# EAGLE design ftdi2kondo2 (EAGLE 5.09)
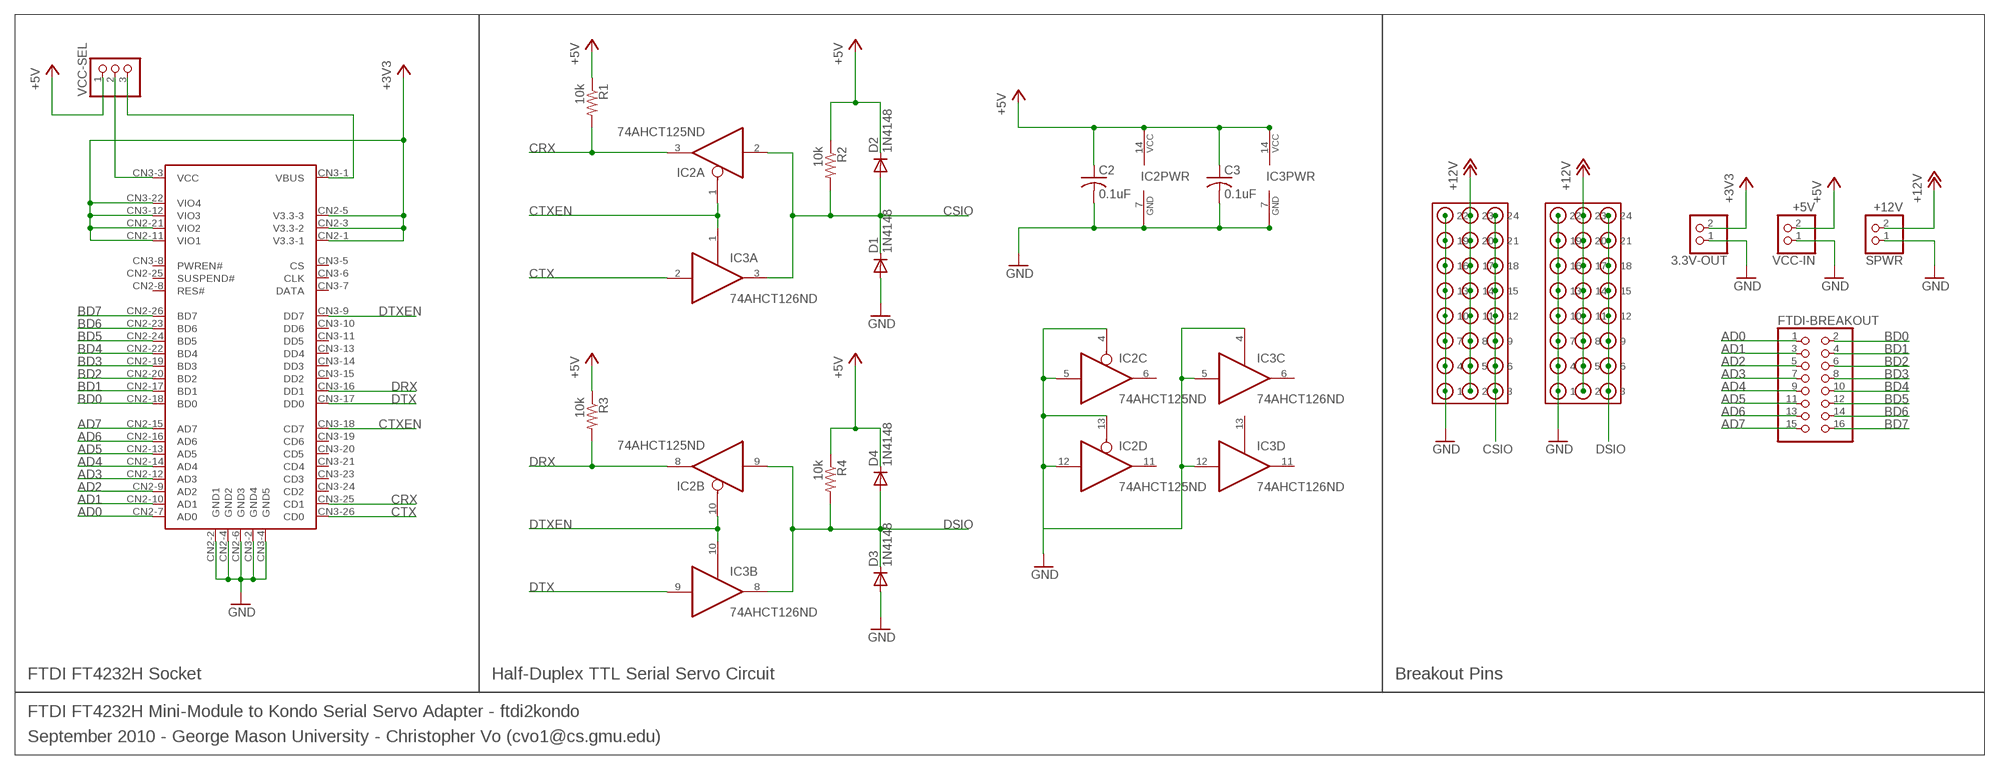
[diagram p0: schematic, sheet 1]

## Parts
3.3V-OUT  PINHD-1X2  [1X02]
C2  0.1uF  C-US025-025X050  [C025-025X050]
C3  0.1uF  C-US025-025X050  [C025-025X050]
CSIO-HEADER  3X8  [3X8]
D1  1N4148  1N4148DO35-7  [DO35-7]
D2  1N4148  1N4148DO35-7  [DO35-7]
D3  1N4148  1N4148DO35-7  [DO35-7]
D4  1N4148  1N4148DO35-7  [DO35-7]
DSIO-HEADER  3X8  [3X8]
FTDI-BREAKOUT  PINHD-2X8  [2X08]
IC1  FT4232HMOD  [FT4232H]
IC2  74AHCT125ND  [SO14]
IC3  74AHCT126ND  [SO14]
R1  10k  R-US_0204/5  [0204/5]
R2  10k  R-US_0204/5  [0204/5]
R3  10k  R-US_0204/5  [0204/5]
R4  10k  R-US_0204/5  [0204/5]
SPWR  +12V  PINHD-1X2  [1X02]
VCC-IN  +5V  PINHD-1X2  [1X02]
VCC-SEL  PINHD-1X3  [1X03]

## Nets
+3V3: 3.3V-OUT.2 IC1.CN2-1(V3.3-1) IC1.CN2-3(V3.3-2) IC1.CN2-5(V3.3-3) IC1.CN2-11(VIO1) IC1.CN2-21(VIO2) IC1.CN3-12(VIO3) IC1.CN3-22(VIO4)
+5V: C2.1 C3.1 D2.C D4.C IC2.14(PWR:VCC) IC3.14(PWR:VCC) R1.1 R2.1 R3.1 R4.1 VCC-IN.2 VCC-SEL.1
+12V: CSIO-HEADER.P$2 CSIO-HEADER.P$5 CSIO-HEADER.P$8 CSIO-HEADER.P$11 CSIO-HEADER.P$14 CSIO-HEADER.P$17 CSIO-HEADER.P$20 CSIO-HEADER.P$23 DSIO-HEADER.P$2 DSIO-HEADER.P$5 DSIO-HEADER.P$8 DSIO-HEADER.P$11 DSIO-HEADER.P$14 DSIO-HEADER.P$17 DSIO-HEADER.P$20 DSIO-HEADER.P$23 SPWR.2
AD0: FTDI-BREAKOUT.1 IC1.CN2-7(AD0)
AD1: FTDI-BREAKOUT.3 IC1.CN2-10(AD1)
AD2: FTDI-BREAKOUT.5 IC1.CN2-9(AD2)
AD3: FTDI-BREAKOUT.7 IC1.CN2-12(AD3)
AD4: FTDI-BREAKOUT.9 IC1.CN2-14(AD4)
AD5: FTDI-BREAKOUT.11 IC1.CN2-13(AD5)
AD6: FTDI-BREAKOUT.13 IC1.CN2-16(AD6)
AD7: FTDI-BREAKOUT.15 IC1.CN2-15(AD7)
BD0: FTDI-BREAKOUT.2 IC1.CN2-18(BD0)
BD1: FTDI-BREAKOUT.4 IC1.CN2-17(BD1)
BD2: FTDI-BREAKOUT.6 IC1.CN2-20(BD2)
BD3: FTDI-BREAKOUT.8 IC1.CN2-19(BD3)
BD4: FTDI-BREAKOUT.10 IC1.CN2-22(BD4)
BD5: FTDI-BREAKOUT.12 IC1.CN2-24(BD5)
BD6: FTDI-BREAKOUT.14 IC1.CN2-23(BD6)
BD7: FTDI-BREAKOUT.16 IC1.CN2-26(BD7)
CRX: IC1.CN3-25(CD1) IC2.3(A:O) R1.2
CSIO: CSIO-HEADER.P$3 CSIO-HEADER.P$6 CSIO-HEADER.P$9 CSIO-HEADER.P$12 CSIO-HEADER.P$15 CSIO-HEADER.P$18 CSIO-HEADER.P$21 CSIO-HEADER.P$24 D1.C D2.A IC2.2(A:I) IC3.3(A:O) R2.2
CTX: IC1.CN3-26(CD0) IC3.2(A:I)
CTXEN: IC1.CN3-18(CD7) IC2.1(A:OE) IC3.1(A:OE)
DRX: IC1.CN3-16(DD1) IC2.8(B:O) R3.2
DSIO: D3.C D4.A DSIO-HEADER.P$3 DSIO-HEADER.P$6 DSIO-HEADER.P$9 DSIO-HEADER.P$12 DSIO-HEADER.P$15 DSIO-HEADER.P$18 DSIO-HEADER.P$21 DSIO-HEADER.P$24 IC2.9(B:I) IC3.8(B:O) R4.2
DTX: IC1.CN3-17(DD0) IC3.9(B:I)
DTXEN: IC1.CN3-9(DD7) IC2.10(B:OE) IC3.10(B:OE)
GND: 3.3V-OUT.1 C2.2 C3.2 CSIO-HEADER.P$1 CSIO-HEADER.P$4 CSIO-HEADER.P$7 CSIO-HEADER.P$10 CSIO-HEADER.P$13 CSIO-HEADER.P$16 CSIO-HEADER.P$19 CSIO-HEADER.P$22 D1.A D3.A DSIO-HEADER.P$1 DSIO-HEADER.P$4 DSIO-HEADER.P$7 DSIO-HEADER.P$10 DSIO-HEADER.P$13 DSIO-HEADER.P$16 DSIO-HEADER.P$19 DSIO-HEADER.P$22 IC1.CN2-2(GND1) IC1.CN2-4(GND2) IC1.CN2-6(GND3) IC1.CN3-2(GND4) IC1.CN3-4(GND5) IC2.4(C:OE) IC2.5(C:I) IC2.7(PWR:GND) IC2.12(D:I) IC2.13(D:OE) IC3.4(C:OE) IC3.5(C:I) IC3.7(PWR:GND) IC3.12(D:I) SPWR.1 VCC-IN.1
N$1: IC1.CN3-3(VCC) VCC-SEL.2
VBUS: IC1.CN3-1(VBUS) VCC-SEL.3
Unconnected: IC1.CN2-8(RES#) IC1.CN2-25(SUSPEND#) IC1.CN3-5(CS) IC1.CN3-6(CLK) IC1.CN3-7(DATA) IC1.CN3-8(PWREN#) IC1.CN3-10(DD6) IC1.CN3-11(DD5) IC1.CN3-13(DD4) IC1.CN3-14(DD3) IC1.CN3-15(DD2) IC1.CN3-19(CD6) IC1.CN3-20(CD5) IC1.CN3-21(CD4) IC1.CN3-23(CD3) IC1.CN3-24(CD2) IC2.6(C:O) IC2.11(D:O) IC3.6(C:O) IC3.11(D:O) IC3.13(D:OE)

## Notes on the sheet
- FTDI FT4232H Socket | Half-Duplex TTL Serial Servo Circuit | Breakout Pins
- FTDI FT4232H Mini-Module to Kondo Serial Servo Adapter - ftdi2kondo
- September 2010 - George Mason University - Christopher Vo (cvo1@cs.gmu.edu)

## Library data of the parts
3.3V-OUT SPWR VCC-IN = pinhead:PINHD-1X2: PIN HEADER
C2 C3 = resistor:C-US: CAPACITOR, American symbol
CSIO-HEADER DSIO-HEADER = ftdi2kondo:3X8
D1-D4 = diode:1N4148: DIODE high speed (Philips)
FTDI-BREAKOUT = pinhead:PINHD-2X8: PIN HEADER
IC1 = ftdi2kondo:FT4232H
IC2 = ftdi2kondo:74*125
IC3 = ftdi2kondo:74*126
R1-R4 = resistor:R-US_: RESISTOR, American symbol
VCC-SEL = pinhead:PINHD-1X3: PIN HEADER

## Board
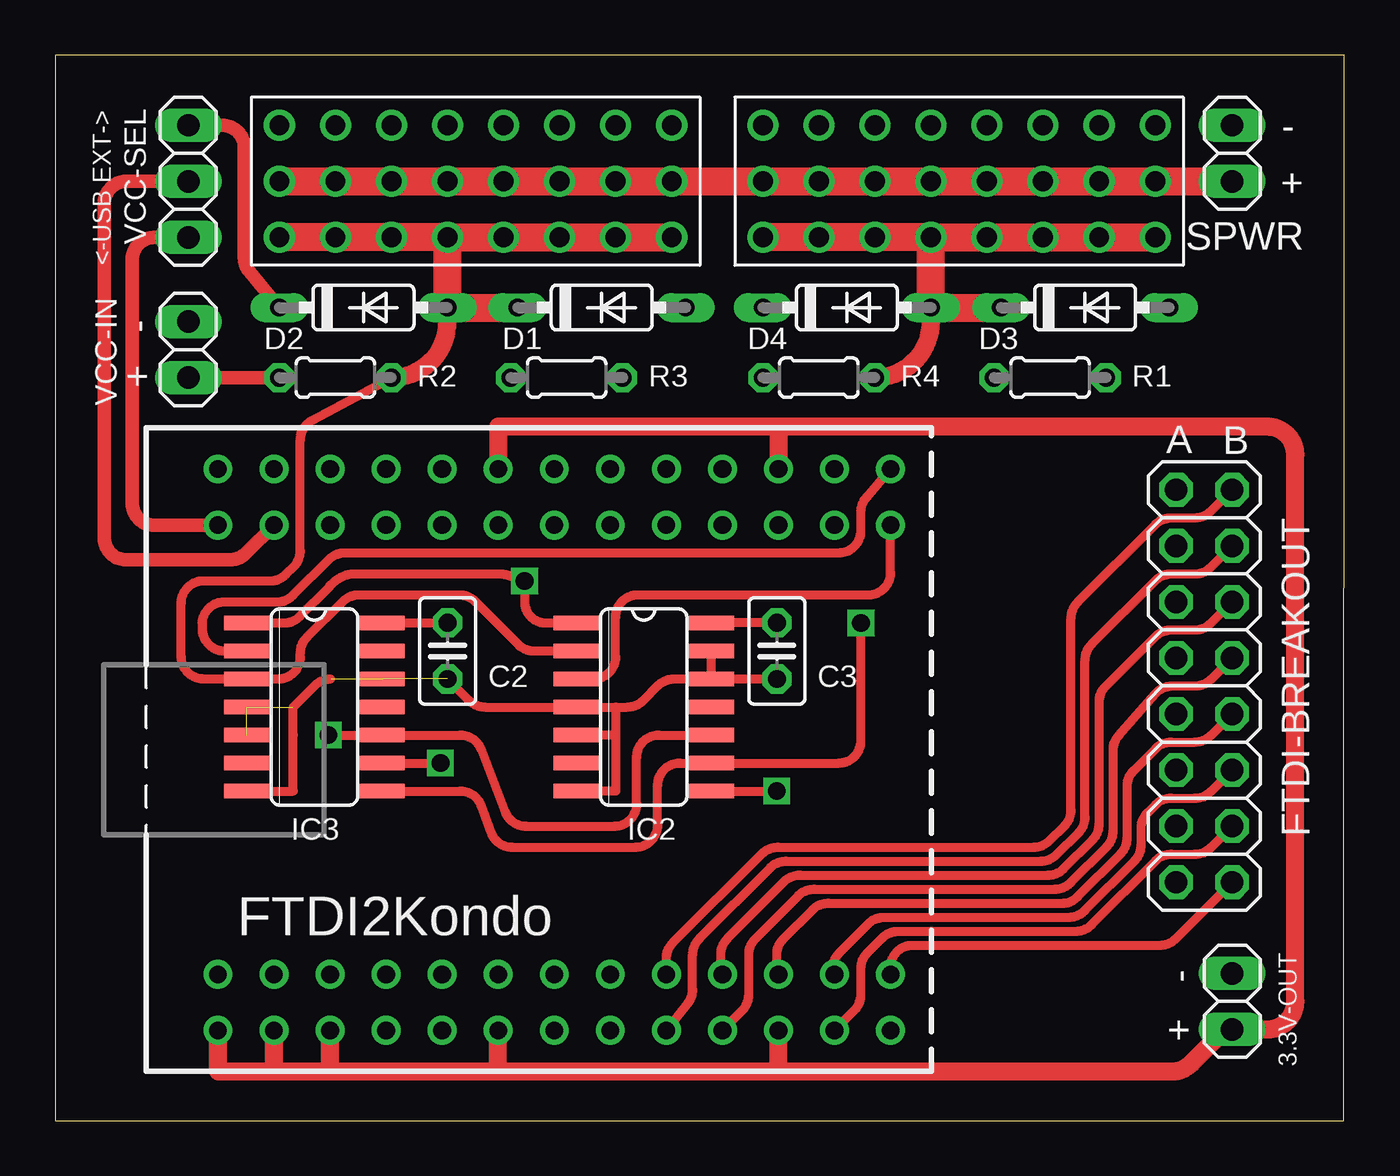
[diagram p1: board, top side]
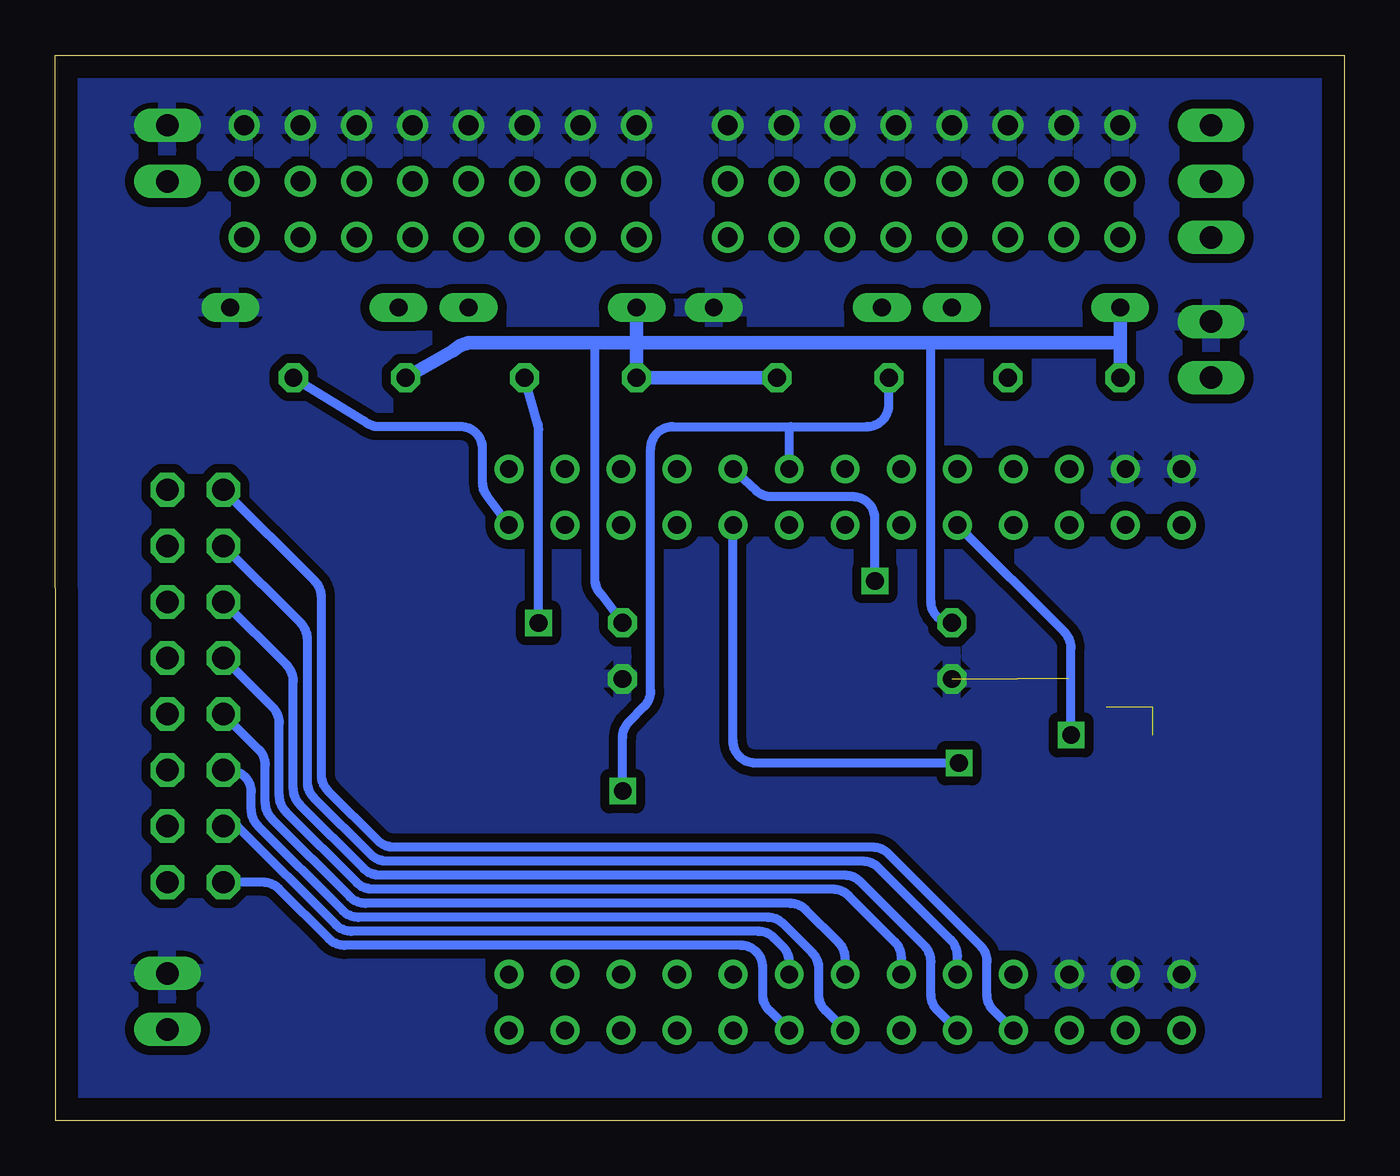
[diagram p2: board, bottom side, seen from below]

Size 58.42 x 48.26 mm. Coordinates in mm from the lower left corner, seen from the top.
Outline: 0,0 58.4,0 58.42,48.26 0,48.26 0,0
Copper layers (1*16): Top 0.035mm / dielectric 1.5mm / Bottom 0.035mm
Design rules "default": minimum track width 10mil, minimum drill 24mil, track to track 8mil, track to pad 8mil, pad to pad 8mil, via to via 8mil, smd to smd 8mil, copper to edge 40mil, drill to drill 8mil, minimum pad ring 10mil, minimum via ring 8mil, stop-mask expansion 4mil, vias tented up to drill 0mil, thermal gap 10mil

### Footprints (pad centres in the part's own frame; a part is rotated, then mirrored left to right if it is on the bottom)
1X02 = drill 1.016 long: 1 -1.27,0; 2 1.27,0
C025-025X050 = drill 0.813 octagon: 1 -1.27,0; 2 1.27,0
3X8 = drill 0.9 round: P$1 0,0; P$2 2.54,0; P$3 5.08,0; P$4 0,2.54; P$5 2.54,2.54; P$6 5.08,2.54; P$7 0,5.08; P$8 2.54,5.08; P$9 5.08,5.08; P$10 0,7.62; P$11 2.54,7.62; P$12 5.08,7.62; P$13 0,10.16; P$14 2.54,10.16; P$15 5.08,10.16; P$16 0,12.7; P$17 2.54,12.7; P$18 5.08,12.7; P$19 0,15.24; P$20 2.54,15.24; P$21 5.08,15.24; P$22 0,17.78; P$23 2.54,17.78; P$24 5.08,17.78
DO35-7 = drill 0.813 long: A 3.81,0; C -3.81,0
2X08 = drill 1.016 octagon: 1 -8.89,-1.27; 2 -8.89,1.27; 3 -6.35,-1.27; 4 -6.35,1.27; 5 -3.81,-1.27; 6 -3.81,1.27; 7 -1.27,-1.27; 8 -1.27,1.27; 9 1.27,-1.27; 10 1.27,1.27; 11 3.81,-1.27; 12 3.81,1.27; 13 6.35,-1.27; 14 6.35,1.27; 15 8.89,-1.27; 16 8.89,1.27
FT4232H = drill 0.8 round: CN2-1 3.25,1.86; CN2-2 3.25,4.4; CN2-3 5.79,1.86; CN2-4 5.79,4.4; CN2-5 8.33,1.86; CN2-6 8.33,4.4; CN2-7 10.87,1.86; CN2-8 10.87,4.4; CN2-9 13.41,1.86; CN2-10 13.41,4.4; CN2-11 15.95,1.86; CN2-12 15.95,4.4; CN2-13 18.49,1.86; CN2-14 18.49,4.4; CN2-15 21.03,1.86; CN2-16 21.03,4.4; CN2-17 23.57,1.86; CN2-18 23.57,4.4; CN2-19 26.11,1.86; CN2-20 26.11,4.4; CN2-21 28.65,1.86; CN2-22 28.65,4.4; CN2-23 31.19,1.86; CN2-24 31.19,4.4; CN2-25 33.73,1.86; CN2-26 33.73,4.4; CN3-1 3.25,24.75; CN3-2 3.25,27.29; CN3-3 5.79,24.75; CN3-4 5.79,27.29; CN3-5 8.33,24.75; CN3-6 8.33,27.29; CN3-7 10.87,24.75; CN3-8 10.87,27.29; CN3-9 13.41,24.75; CN3-10 13.41,27.29; CN3-11 15.95,24.75; CN3-12 15.95,27.29; CN3-13 18.49,24.75; CN3-14 18.49,27.29; CN3-15 21.03,24.75; CN3-16 21.03,27.29; CN3-17 23.57,24.75; CN3-18 23.57,27.29; CN3-19 26.11,24.75; CN3-20 26.11,27.29; CN3-21 28.65,24.75; CN3-22 28.65,27.29; CN3-23 31.19,24.75; CN3-24 31.19,27.29; CN3-25 33.73,24.75; CN3-26 33.73,27.29
SO14 = smd 0.66 x 2.032: 1 0,0.737; 2 1.27,0.737; 3 2.54,0.737; 4 3.81,0.737; 5 5.08,0.737; 6 6.35,0.737; 7 7.62,0.737; 8 7.62,6.883; 9 6.35,6.883; 10 5.08,6.883; 11 3.81,6.883; 12 2.54,6.883; 13 1.27,6.883; 14 0,6.883
0204/5 = drill 0.813 octagon: 1 -2.54,0; 2 2.54,0
1X03 = drill 1.016 long: 1 -2.54,0; 2 0,0; 3 2.54,0

### Placement (x,y rotation side)
3.3V-OUT  53.34,5.4 270 top
C2  17.78,21.27 270 top
C3  32.7,21.27 270 top
CSIO-HEADER  10.16,45.09 270 top
D1  24.77,36.83 0 top
D2  13.97,36.83 0 top
D3  46.67,36.83 0 top
D4  35.88,36.83 0 top
DSIO-HEADER  32.07,45.09 270 top
FTDI-BREAKOUT  52.07,19.68 270 top
IC1  4.13,2.22 0 top
IC2  22.86,22.54 270 top
IC3  7.94,22.54 270 top
R1  45.09,33.66 0 top
R2  12.7,33.66 0 top
R3  23.18,33.66 180 top
R4  34.61,33.66 0 top
SPWR  53.34,43.81 270 top
VCC-IN  6.03,34.92 270 top
VCC-SEL  6.03,42.55 270 top

### Tracks (layer width: path | path; a pad name or v marks a point on that pad's centre or on a via)
+3V3
  Top 0.813: 9.84,2.22 7.39,2.22 arc-45 7.38,2.26 IC1.CN2-1 | 9.84,2.22 12.38,2.22 | 12.38,2.22 20,2.22 | 20,2.22 32.7,2.22 | 32.7,2.22 50.59,2.22 arc45 51.49,2.6 53.02,4.13 3.3V-OUT.2 54.93,4.13 arc90 56.2,5.4 56.2,30.16 arc90 54.93,31.43 32.78,31.43 | IC1.CN2-5 12.46,2.3 12.38,2.22 | IC1.CN2-21 32.78,2.3 32.7,2.22 | IC1.CN2-11 20.08,2.3 20,2.22 | IC1.CN3-12 20.08,31.43 32.78,31.43 | 32.78,31.43 IC1.CN3-22 | IC1.CN2-3 9.92,2.3 arc-90 9.84,2.22
+5V
  Top 0.406: IC3.14 C2.1 | C3.1 IC2.14
  Top 0.61: VCC-SEL.1 7.57,45.09 arc-90 8.57,44.09 8.57,39.1 arc40 8.8,38.46 D2.C | R2.1 VCC-IN.2
  Bottom 0.406: C2.1 arc90 18.73,23.5 18.73,35.24 | C3.1 33.68,23.84 arc45 33.97,24.54 33.97,35.24
  Bottom 0.61: 10.16,35.24 18.73,35.24 32.07,35.24 | 32.07,35.24 33.97,35.24 39.48,35.24 arc-45 40.38,34.87 R1.1 | 10.16,35.24 R2.1 | 10.16,35.24 D2.C | R3.1 R4.1 32.07,35.24 | 32.07,35.24 D4.C
+12V
  Top 1.27: CSIO-HEADER.P$2 CSIO-HEADER.P$5 CSIO-HEADER.P$8 CSIO-HEADER.P$11 CSIO-HEADER.P$14 CSIO-HEADER.P$17 CSIO-HEADER.P$20 CSIO-HEADER.P$23 DSIO-HEADER.P$2 DSIO-HEADER.P$5 DSIO-HEADER.P$8 DSIO-HEADER.P$11 DSIO-HEADER.P$14 DSIO-HEADER.P$17 DSIO-HEADER.P$20 DSIO-HEADER.P$23 SPWR.2
AD0
  Bottom 0.406: FTDI-BREAKOUT.1 46.65,24.42 arc45 46.35,23.72 46.35,15.65 arc-45 46.06,14.95 43.79,12.68 arc-45 43.08,12.38 21.37,12.38 arc45 20.66,12.09 16.48,7.91 arc45 16.19,7.21 16.19,5.69 arc-45 15.9,4.99 IC1.CN2-7
AD1
  Bottom 0.406: FTDI-BREAKOUT.3 47.28,22.52 arc45 46.99,21.81 46.99,15.34 arc-45 46.7,14.63 44.11,12.04 arc-45 43.4,11.75 21.82,11.75 arc45 21.11,11.46 17.83,8.17 arc45 17.53,7.46 IC1.CN2-10
AD2
  Bottom 0.406: FTDI-BREAKOUT.5 47.92,20.61 arc45 47.62,19.91 47.62,15.02 arc-45 47.33,14.31 44.42,11.4 arc-45 43.72,11.11 22.64,11.11 arc45 21.93,10.82 19.02,7.91 arc45 18.73,7.21 18.73,5.69 arc-45 18.44,4.99 IC1.CN2-9
AD3
  Bottom 0.406: FTDI-BREAKOUT.7 48.55,18.71 arc45 48.26,18 48.26,14.7 arc-45 47.97,13.99 44.74,10.77 arc-45 44.04,10.48 23.17,10.48 arc45 22.46,10.19 20.36,8.08 arc45 20.07,7.37 20.07,6.63 IC1.CN2-12
AD4
  Bottom 0.406: FTDI-BREAKOUT.9 49.19,16.8 arc45 48.9,16.1 48.9,14.38 arc-45 48.6,13.68 45.06,10.13 arc-45 44.35,9.84 25.12,9.84 arc45 24.41,9.55 22.91,8.05 arc45 22.62,7.34 IC1.CN2-14
AD5
  Bottom 0.406: FTDI-BREAKOUT.11 50.53,15.88 arc90 49.53,14.88 49.53,14.07 arc-45 49.24,13.36 45.38,9.5 arc-45 44.67,9.21 26.13,9.21 arc45 25.43,8.91 24.11,7.59 arc45 23.81,6.89 23.81,5.69 arc-45 23.52,4.99 IC1.CN2-13
AD6
  Bottom 0.406: FTDI-BREAKOUT.13 50.16,13.34 45.7,8.87 arc-45 44.99,8.57 26.56,8.57 arc45 25.85,8.28 25.44,7.88 arc45 25.15,7.17 IC1.CN2-16
AD7
  Bottom 0.406: FTDI-BREAKOUT.15 48.99,10.79 arc45 48.28,10.5 46.01,8.23 arc-45 45.31,7.94 27.35,7.94 arc90 26.35,6.94 26.35,5.69 arc-45 26.06,4.99 IC1.CN2-15
BD0
  Top 0.406: FTDI-BREAKOUT.2 52.36,27.6 arc-45 51.66,27.3 50.58,27.3 arc45 49.87,27.01 46.33,23.47 arc45 46.04,22.76 46.04,14.07 arc-45 45.74,13.36 45.06,12.68 arc-45 44.35,12.38 32.74,12.38 arc45 32.03,12.09 27.99,8.04 arc45 27.69,7.33 IC1.CN2-18
BD1
  Top 0.406: FTDI-BREAKOUT.4 52.36,25.06 arc-45 51.66,24.77 50.58,24.77 arc45 49.87,24.47 46.97,21.57 arc45 46.67,20.86 46.67,13.75 arc-45 46.38,13.04 45.38,12.04 arc-45 44.67,11.75 33.12,11.75 arc45 32.41,11.46 29.18,8.23 arc45 28.89,7.52 28.89,5.94 arc-38 28.68,5.32 IC1.CN2-17
BD2
  Top 0.406: FTDI-BREAKOUT.6 52.36,22.52 arc-45 51.66,22.23 50.58,22.23 arc45 49.87,21.93 47.6,19.66 arc45 47.31,18.95 47.31,13.43 arc-45 47.02,12.72 45.7,11.41 arc-47 44.99,11.11 33.76,11.12 arc45 33.05,10.83 30.45,8.23 arc45 30.16,7.52 30.16,6.63 IC1.CN2-20
BD3
  Top 0.406: FTDI-BREAKOUT.8 52.36,19.98 arc-45 51.66,19.68 50.62,19.68 arc49 49.87,19.34 48.19,17.43 arc41 47.94,16.77 47.94,13.11 arc-45 47.65,12.41 46.01,10.77 arc-45 45.31,10.48 34.39,10.48 arc45 33.68,10.19 31.73,8.23 arc45 31.43,7.52 31.43,5.69 arc-45 31.14,4.99 IC1.CN2-19
BD4
  Top 0.406: FTDI-BREAKOUT.10 52.36,17.44 arc-45 51.66,17.14 50.58,17.14 arc45 49.87,16.85 48.87,15.85 arc45 48.58,15.14 48.58,12.8 arc-45 48.28,12.09 46.33,10.14 arc-50 45.62,9.84 35.04,9.85 arc45 34.34,9.55 33,8.23 arc45 32.7,7.52 32.7,6.63 IC1.CN2-22
BD5
  Top 0.406: FTDI-BREAKOUT.12 52.36,14.9 arc-45 51.66,14.61 50.58,14.61 arc45 49.87,14.31 49.51,13.95 arc45 49.21,13.24 49.21,12.48 arc-45 48.92,11.77 46.65,9.5 arc-45 45.94,9.21 37.56,9.21 arc45 36.85,8.91 35.53,7.59 arc45 35.24,6.89 35.24,6.63 IC1.CN2-24
BD6
  Top 0.406: FTDI-BREAKOUT.14 52.36,12.36 arc-45 51.66,12.06 50.58,12.06 arc45 49.87,11.77 46.97,8.87 arc-45 46.26,8.57 38.2,8.57 arc45 37.49,8.28 36.8,7.59 arc45 36.51,6.89 36.51,5.69 arc-45 36.22,4.99 IC1.CN2-23
BD7
  Top 0.406: FTDI-BREAKOUT.16 50.77,8.23 arc-45 50.07,7.94 38.85,7.94 arc91 37.85,6.92 IC1.CN2-26
CRX
  Top 0.406: IC2.3 24.4,20 arc90 25.4,21 25.4,22.81 arc-90 26.4,23.81 36.86,23.81 arc90 37.86,24.81 IC1.CN3-25
  Bottom 0.406: R1.2 44.41,31.68 arc-41 43.76,31.43 40.05,31.43 arc90 39.05,30.43 39.05,28.91 arc-37 38.85,28.31 IC1.CN3-25
CSIO
  Top 0.406: IC2.2 21.69,21.27 arc-45 20.98,21.57 19.02,23.52 arc45 18.32,23.81 13.75,23.81 arc45 13.04,23.52 11.4,21.88 arc45 11.11,21.18 11.11,21 arc-90 10.11,20 IC3.3 6.71,20 arc-90 5.71,21 5.71,23.45 arc-90 6.71,24.45 9.75,24.45 arc45 10.45,24.74 10.82,25.11 arc45 11.11,25.81 11.11,30.84 arc-62 11.64,31.72 R2.2
  Top 0.813: D2.A 17.78,36.2 arc-90 R2.2
  Top 1.27: CSIO-HEADER.P$3 CSIO-HEADER.P$6 CSIO-HEADER.P$9 CSIO-HEADER.P$12 | CSIO-HEADER.P$12 CSIO-HEADER.P$15 CSIO-HEADER.P$18 CSIO-HEADER.P$21 CSIO-HEADER.P$24 | D1.C D2.A CSIO-HEADER.P$12
CTX
  Top 0.406: IC3.2 7.67,21.27 arc-90 6.67,22.27 6.67,22.5 arc-90 7.67,23.5 10.06,23.5 arc45 10.77,23.79 12.41,25.43 arc-45 13.11,25.72 35.51,25.72 arc90 36.51,26.72 36.51,27.57 arc-41 36.75,28.22 IC1.CN3-26
CTXEN  (via drill 0.8)
  Top 0.406: IC3.1 10.38,22.54 arc45 11.09,22.84 12.41,24.16 arc-45 13.43,24.77 20.16,24.77 arc-18 20.47,24.71 v21.27,24.45 21.27,23.5 arc90 22.23,22.54 IC2.1
  Bottom 0.406: v21.27,24.45 21.27,27.26 arc-90 22.27,28.26 25.96,28.26 arc43 26.64,28.53 IC1.CN3-18
DRX  (via drill 0.8)
  Top 0.406: IC2.8 v32.7,14.92
  Bottom 0.406: v32.7,14.92 32.7,17.37 arc45 32.41,18.07 31.73,18.76 arc-45 31.43,19.46 31.43,30.43 arc90 30.43,31.43 25.08,31.43 | 25.08,31.43 21.64,31.43 arc-90 20.64,32.43 R3.2 | 25.08,31.43 25.16,31.36 IC1.CN3-16
DSIO  (via drill 0.8)
  Top 0.406: IC3.8 18.36,14.92 arc-69 19.29,14.27 19.76,13.03 arc69 20.7,12.38 26.3,12.38 arc90 27.3,13.38 27.3,15.19 arc-90 28.3,16.19 IC2.9 35.51,16.19 arc90 36.51,17.19 v36.51,22.54
  Top 0.813: D4.A 39.69,36.2 arc-90 R4.2
  Top 1.27: DSIO-HEADER.P$3 DSIO-HEADER.P$6 DSIO-HEADER.P$9 DSIO-HEADER.P$12 | DSIO-HEADER.P$12 DSIO-HEADER.P$15 DSIO-HEADER.P$18 DSIO-HEADER.P$21 DSIO-HEADER.P$24 | D3.C D4.A DSIO-HEADER.P$12
  Bottom 0.406: v36.51,22.54 36.51,31.29 arc-16 36.55,31.57 R4.2
DTX  (via drill 0.8)
  Top 0.406: IC3.9 v17.46,16.19
  Bottom 0.406: v17.46,16.19 26.7,16.19 arc90 27.7,17.19 IC1.CN3-17
DTXEN  (via drill 0.8)
  Top 0.406: IC2.10 27.35,17.46 arc90 26.35,16.46 26.35,14.34 arc-90 25.35,13.34 21.32,13.34 arc-69 20.39,13.98 19.3,16.82 arc69 18.36,17.46 IC3.10 v12.38,17.46
  Bottom 0.406: v12.38,17.46 12.38,21.4 arc-45 12.68,22.11 IC1.CN3-9
GND  (4 unrouted)
  Top 0.406: IC2.12 IC2.13 | IC2.12 C3.2 | IC2.7 25.4,14.92 25.4,17.46 | 25.4,18.73 25.4,17.46 | 25.4,18.73 IC2.4 19.46,18.73 arc-45 18.76,19.02 C2.2 | 25.4,17.46 IC2.5 | 25.4,18.73 25.94,18.73 arc45 26.64,19.02 27.33,19.71 arc-45 28.04,20 IC2.12 | IC3.7 10.79,14.92 10.79,17.46 10.79,18.73 11.77,19.71 arc-45 12.48,20
  pour Bottom (isolate 0.406): 0,0 0,48.26 58.42,48.26 58.42,0
N$1
  Top 0.61: VCC-SEL.2 3.22,42.55 arc90 2.22,41.55 2.22,26.4 arc90 3.22,25.4 7.93,25.4 arc45 8.64,25.69 IC1.CN3-3
VBUS
  Top 0.61: VCC-SEL.3 4.49,40.01 arc90 3.49,39.01 3.49,27.96 arc90 4.49,26.96 7.37,26.96 IC1.CN3-1

### Text on the board
tPlace: - | + | VCC-SEL | <-USB EXT-> | - | + | A | B | FTDI2Kondo | - | +